# Altium schematic sheet 01. Cover.SchDoc
size A3
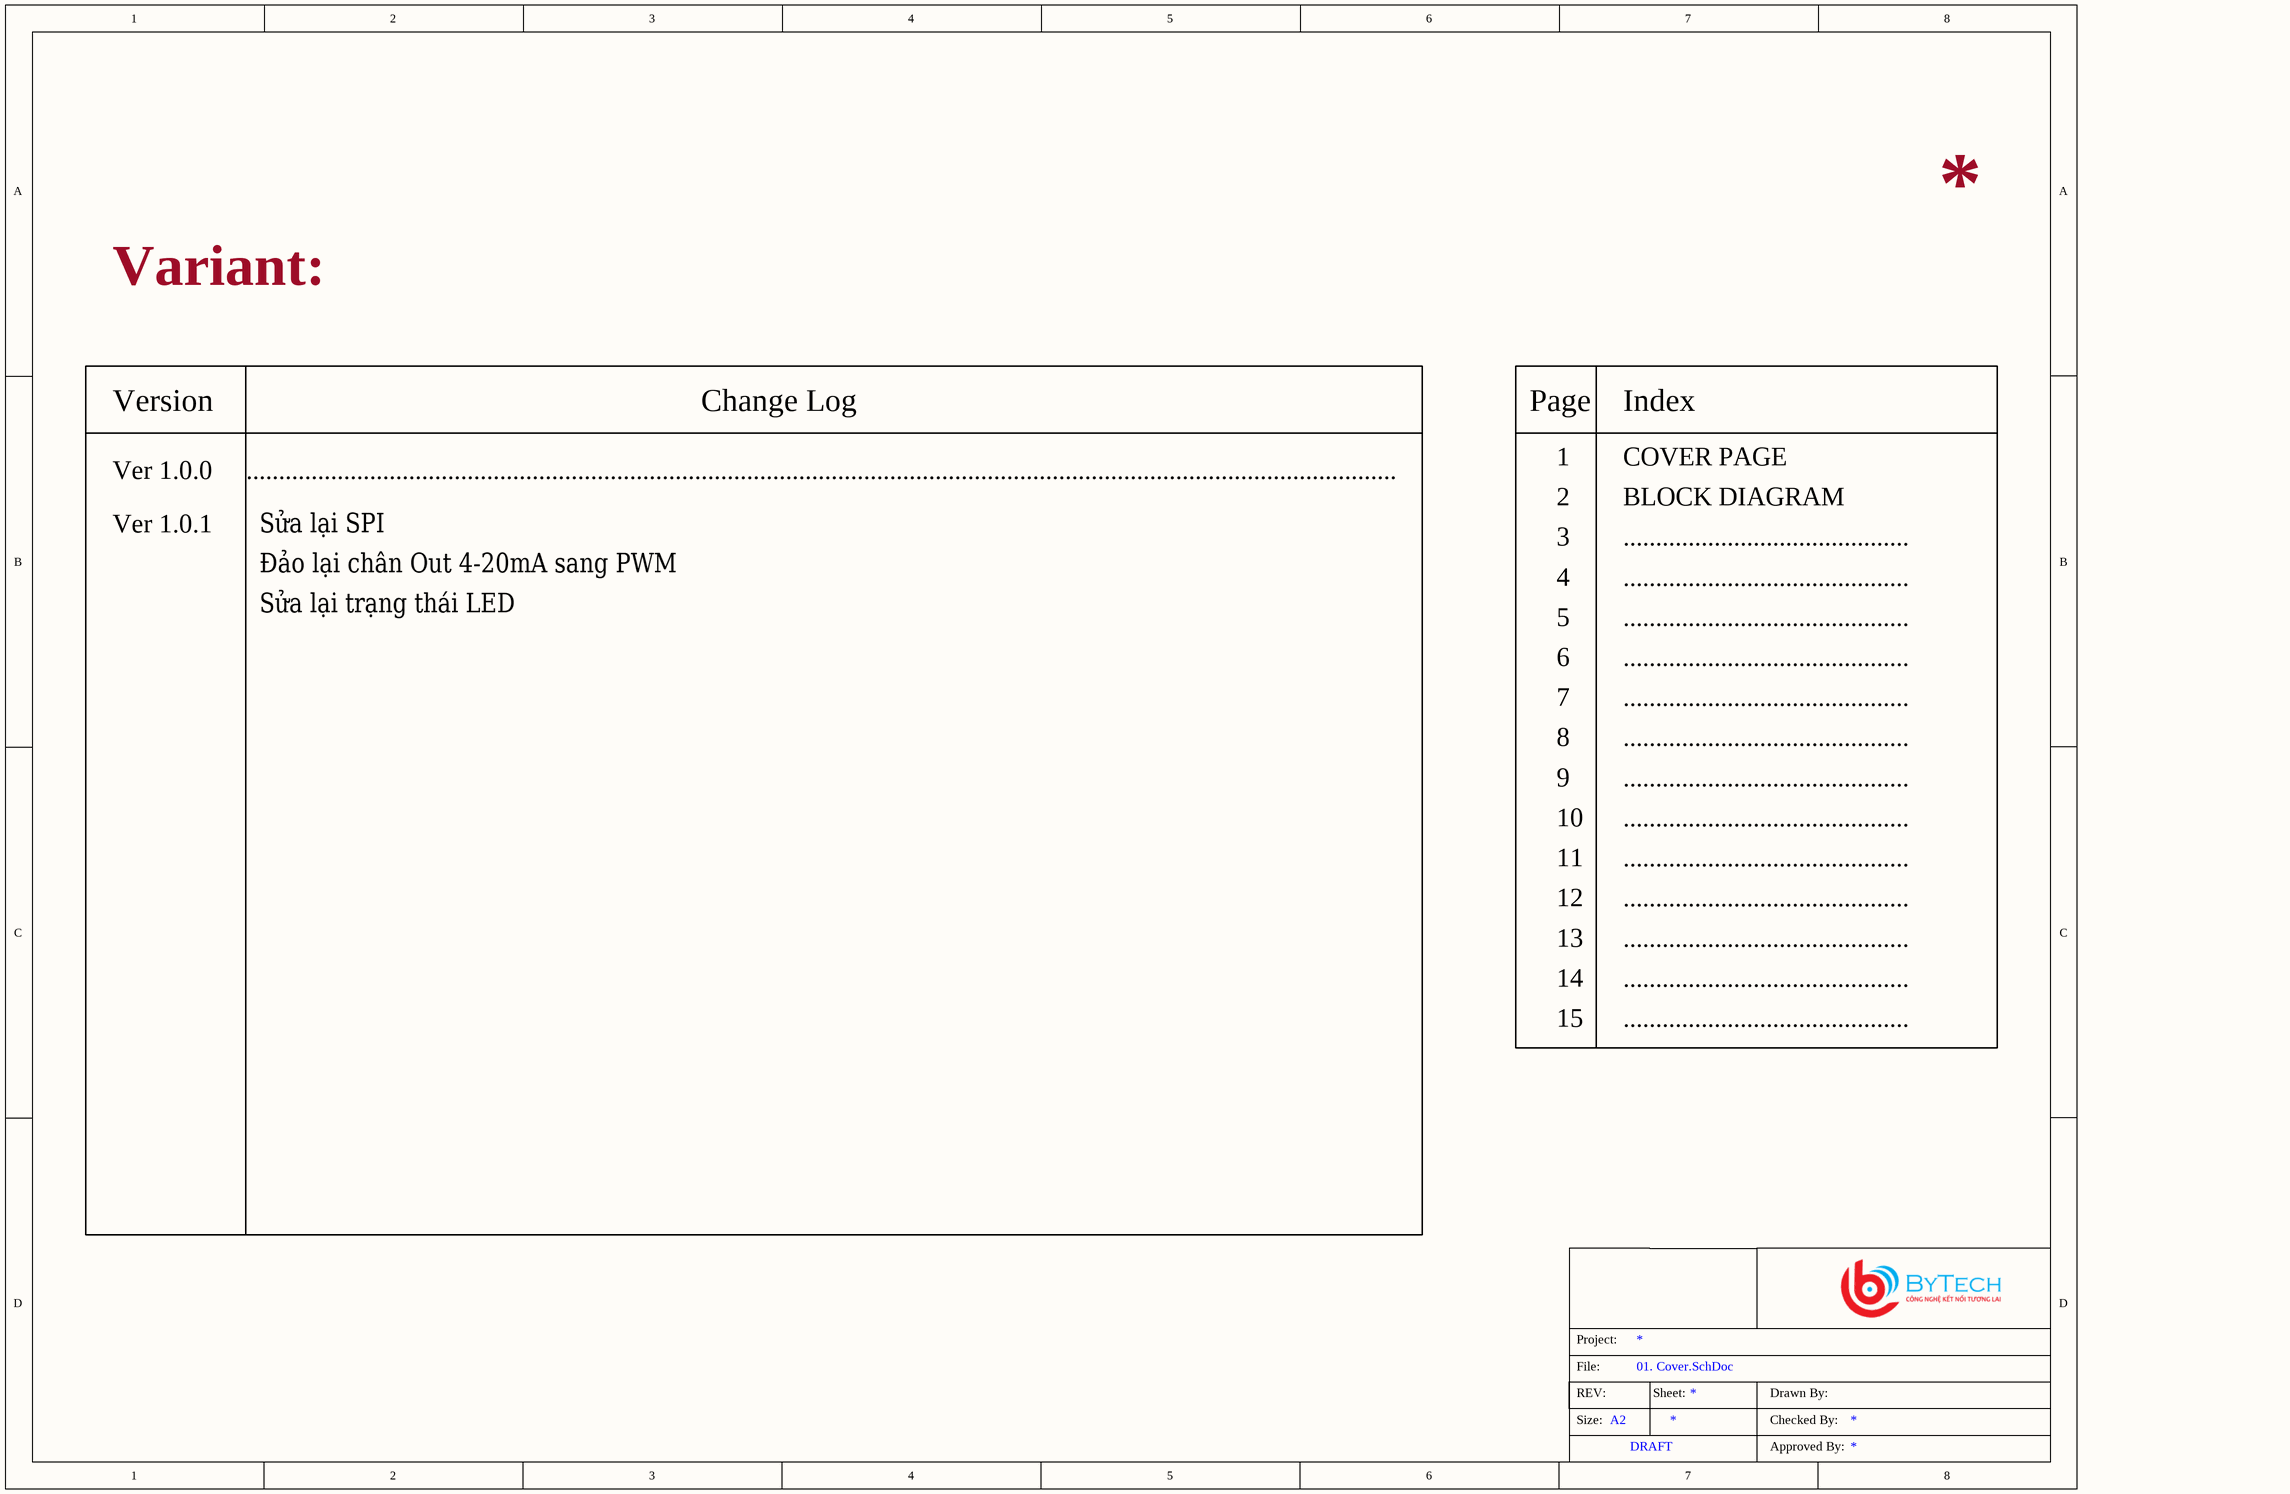
[diagram p0: 01. Cover.SchDoc]

## Notes on the sheet
- Variant:
- Version
- Change Log
- Page
- Index
- Ver 1.0.0
- .................................................................................................................................................................................
- 1
- 2
- COVER PAGE
- BLOCK DIAGRAM
- Ver 1.0.1
- Sửa lại SPI
- Đảo lại chân Out 4-20mA sang PWM
- 3
- ............................................
- Sửa lại trạng thái LED
- 4
- 5
- 6
- 7
- 8
- 9
- 10
- 11
- 12
- 13
- 14
- 15
- File:
- Project:
- REV:
- Size:
- A2
- Sheet:
- Drawn By:
- Checked By:
- DRAFT
- Approved By: